# Altium schematic sheet YakupTrkn.SchDoc
size A4
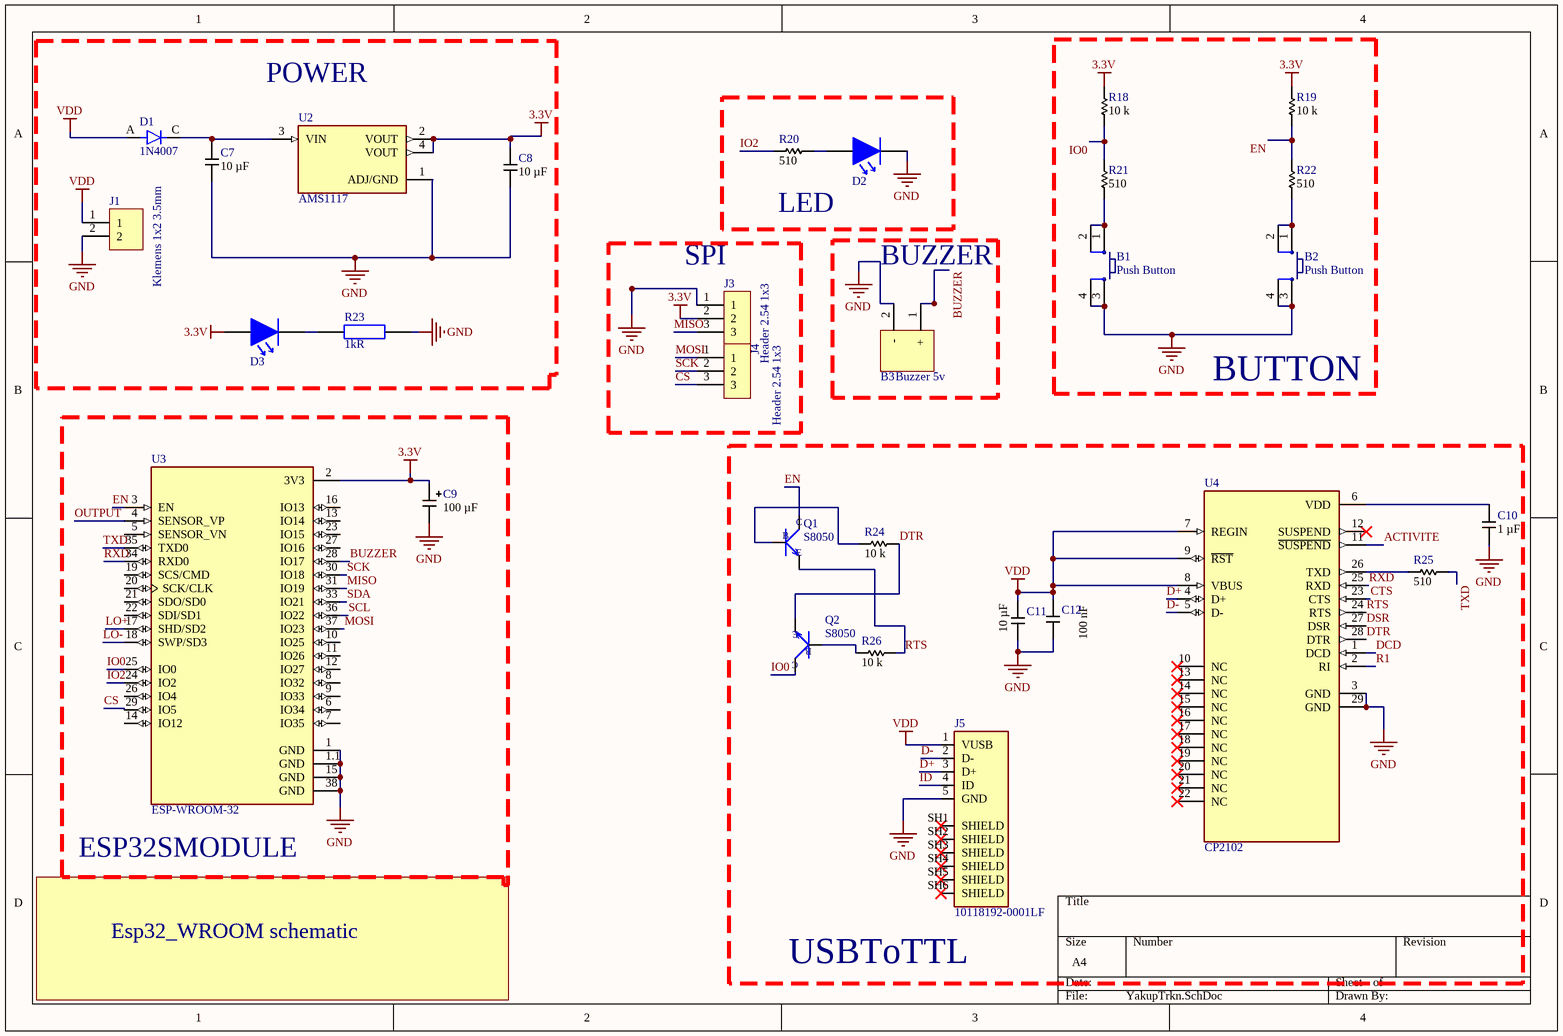
[diagram p0: YakupTrkn.SchDoc]

## Parts
B1  Push Button  [PUSB BUTTON-SMD]
B2  Push Button  [PUSB BUTTON-SMD]
B3  Buzzer 5v  [Buzzer 5v]
C7  Capacitance: 10 µF  [SAMSUNG_CAP_0805_140]  (hidden comment: CL21B106KPQNNNE)
C8  Capacitance: 10 µF  [SAMSUNG_CAP_0805_140]  (hidden comment: CL21B106KPQNNNE)
C9  Capacitance: 100 µF  [KEMET_CAP_TAN-B]  (hidden comment: T491B107K006AT)
C10  Capacitance: 1 µF  [SAMSUNG_CAP_0805_135]  (hidden comment: CL21B105KBFNNNE)
C11  Capacitance: 10 µF  [SAMSUNG_CAP_0805_140]  (hidden comment: CL21B106KPQNNNE)
C12  Capacitance: 100 nF  [SAMSUNG_CAP_0805_075]  (hidden comment: CL21B222KBANNNC)
D1  1N4007  [DIOAD1060W80L520D270]
D2  LTST-C171GKT  [LED_GREEN_0805]  (value not drawn)
D3  LH R974-LP-1  [LED_RED_0805]  (value not drawn)
J1  Klemens 1x2 3.5mm  [Klemens 1x2 - 3.5mm]
J3  Header 2.54 1x3  [Header 2.54 1x3]
J4  Header 2.54 1x3  [Header 2.54 1x3]
J5  10118192-0001LF  [AMPHENOL_10118192-0001LF]
Q1  S8050  [SOT-23]
Q2  S8050  [SOT-23]
R18  Resistance: 10 k  [ROYALOHM_RES_0805]  (hidden comment: 0805S8J0103T5E)
R19  Resistance: 10 k  [ROYALOHM_RES_0805]  (hidden comment: 0805S8J0103T5E)
R20  Resistance: 510  [ROYALOHM_RES_1206]  (hidden comment: 1206S4F5100T5E)
R21  Resistance: 510  [ROYALOHM_RES_1206]  (hidden comment: 1206S4F5100T5E)
R22  Resistance: 510  [ROYALOHM_RES_1206]  (hidden comment: 1206S4F5100T5E)
R23  Resistance: 1kR  [RES_0603]  (hidden comment: RC0603FR-0710KL)
R24  Resistance: 10 k  [ROYALOHM_RES_0805]  (hidden comment: 0805S8J0103T5E)
R25  Resistance: 510  [ROYALOHM_RES_1206]  (hidden comment: 1206S4F5100T5E)
R26  Resistance: 10 k  [ROYALOHM_RES_0805]  (hidden comment: 0805S8J0103T5E)
U2  AMS1117  [SOT229P700X180-4N]
U3  ESP-WROOM-32  [MODULE_ESP-WROOM-32]
U4  CP2102  [QFN50P500X500X100-29N]

## Nets
3.3V: C8.2 C9.1 D3.2 J3.2 R18.2 R19.2 U2.2(VOUT) U2.4(VOUT) U3.2(3V3)
GND: B1.3 B1.4 B2.3 B2.4 B3.2(-) C7.1 C8.1 C9.2 C10.2 C11.2 C12.1 D2.1 J1.2 J3.1 J5.5(GND) R23.1 U2.1(ADJ/GND) U3.1(GND) U3.1.1(GND) U3.15(GND) U3.38(GND) U4.3(GND) U4.29(GND)
VDD: C11.1 C12.2 D1.A J1.1 J5.1(VUSB) U4.7(REGIN) U4.8(VBUS) U4.9(~{RST})
ACTIVITE: U4.11(~{SUSPEND})
BUZZER: B3.1(+) U3.28(IO17)
CS: J4.3 U3.29(IO5)
CTS: U4.23(CTS)
D+: J5.3(D+) U4.4(D+)
D-: J5.2(D-) U4.5(D-)
DCD: U4.1(DCD)
DSR: U4.27(DSR)
DTR: Q2.2(E) R24.1 U4.28(DTR)
EN: Q1.3(C) R19.1 R22.1 U3.3(EN)
ID: J5.4(ID)
IO0: Q2.3(C) R18.1 R21.1 U3.25(IO0)
IO2: R20.1 U3.24(IO2)
LO+: U3.17(SHD/SD2)
LO-: U3.18(SWP/SD3)
MISO: J3.3 U3.31(IO19)
MOSI: J4.1 U3.37(IO23)
OUTPUT: U3.4(SENSOR_VP)
R1: U4.2(RI)
RTS: Q1.2(E) R26.2 U4.24(RTS)
RXD: U3.34(RXD0) U4.25(RXD)
SCK: J4.2 U3.30(IO18)
SCL: U3.36(IO22)
SDA: U3.33(IO21)
TXD: R25.2 U3.35(TXD0)
NetB1_1: B1.1 B1.2 R21.2
NetB2_1: B2.1 B2.2 R22.2
NetC7_2: C7.2 D1.C U2.3(VIN)
NetC10_1: C10.1 U4.6(VDD)
NetD2_2: D2.2 R20.2
NetD3_1: D3.1 R23.2
NetQ1_1: Q1.1(B) R24.2
NetQ2_1: Q2.1(B) R26.1
NetR25_1: R25.1 U4.26(TXD)

Not connected (* = marked no-connect by the designer): J5 SH1(SHIELD)* SH2(SHIELD)* SH3(SHIELD)* SH4(SHIELD)* SH5(SHIELD)* SH6(SHIELD)*; U3 5(SENSOR_VN) 6(IO34) 7(IO35) 8(IO32) 9(IO33) 10(IO25) 11(IO26) 12(IO27) 13(IO14) 14(IO12) 16(IO13) 19(SCS/CMD) 20(SCK/CLK) 21(SDO/SD0) 22(SDI/SD1) 23(IO15) 26(IO4) 27(IO16); U4 10(NC)* 12(SUSPEND)* 13(NC)* 14(NC)* 15(NC)* 16(NC)* 17(NC)* 18(NC)* 19(NC)* 20(NC)* 21(NC)* 22(NC)*

## Notes on the sheet
- (near U2) POWER
- LED
- (near J3) SPI
- BUZZER
- BUTTON
- (near U3) ESP32SMODULE
- Esp32_WROOM schematic
- (near J5) USBToTTL

## Library data of the parts
B1 B2 = Push Button: Smd Push Button; Satın Alma Linki: https://urun.n11.com/diger/mini-pushbutton-switch-smd-P227461537?gclid=Cj0KCQjwkoDmBRCcARIsAG3xzl8Y_-jeD7HocNM6lvuZ_rVp83568XPGtNzlPwXWLph8oCRqo0yh87UaApZYEALw_wcB&gclsrc=aw.ds
C7 C8 C11 = CL21B106KPQNNNE: CAP CER 10UF 10V X7R 0805; Supplier 1: Digi-Key; Supplier 2: Farnell; Supplier 3: Mouser; Supplier Part Number 1: 1276-1764-6-ND; Supplier Part Number 2: 3013487; Supplier Part Number 3: 187-CL21B106KPQNNNE
C9 = T491B107K006AT: CAP TANT 100UF 10% 6.3V 1411; Supplier 1: Digi-Key; Supplier 2: Farnell; Supplier 3: Mouser; Supplier Part Number 1: 399-8301-1-ND; Supplier Part Number 2: 1457438; Supplier Part Number 3: 80-T491B107K006
C10 = CL21B105KBFNNNE: CAP CER 1UF 50V X7R 0805; Supplier 1: Digi-Key; Supplier 2: Farnell; Supplier 3: Mouser; Supplier Part Number 1: 1276-1029-1-ND; Supplier Part Number 2: 3013482; Supplier Part Number 3: 187-CL21B105KBFNNNE
C12 = CL21B222KBANNNC: CAP CER 100NnF 50V X7R 0805; Supplier 1: Digi-Key; Supplier 2: Farnell; Supplier 3: Mouser; Supplier Part Number 1: 1276-1171-1-ND; Supplier Part Number 2: 3013488; Supplier Part Number 3: 187-CL21B222KBANNNC
D1 = 1N4007: Diode Switching 1KV 1A 2-Pin DO-41; MF: {'manufacturer': u'ON Semiconductor'}; MP: 1N4007; Availability: Unavailable; Value: *; Package: None; Price: None
D2 = LED GREEN 0805: Green 0805 130 º Min 5 mcd Typical 12 mcd Water Clear Lens SMT LED; Manufacturer: Vishay Lite-On; Designed by: BERK; Lens Color: Colorless; Viewing Angle: 130°; Lens Style: Diffused,Colorless,Rectangular,Clear; Luminous Intensity: 12mcd; Forward Current: 30mA; Forward Voltage: 2.1V; Power Rating: 100mW; Dominant Wavelength: 569nm; Test Current: 10mA; Number of Elements: 1; Wavelength: 585nm; Reverse Voltage: 5V; Supplier 1: Digi-Key; Manufacturer Part Number: LTST-C171GKT; RoHS: Yes; Category: LEDs; Stock 1: 159023; Pricing 1: 1=0,26000, 10=0,14100, 100=0,06560, 500=0,06060, 1000=0,04747 (USD); Mount: Surface Mount; Case/Package: 0805; Number of Pins: 2; Color: Green; Case Code (Metric): 2012; Case Code (Imperial): 0805; Min Operating Temperature: -55°C; Max Operating Temperature: 85°C; Package Quantity: 1; Packaging: Tape and Reel; Illumination Color: Green; Lens Transparency: Clear; Power Dissipation: 100mW; Number of LEDs: 1; Series: CHIPLED 0805; Length: 2mm; Width: 1.25mm; Height: 0.8mm; Depth: 1.25mm; Radiation Hardening: No; Lead Free: Lead Free; RoHS Compliant: Yes; ComponentLink1URL: https://datasheet.ciiva.com/2110/ltst-c171gkt-2110000.pdf?src-supplier=Digi-Key; ComponentLink1Description: https://datasheet.ciiva.com/2110/ltst-c171gkt-2110000.pdf?src-supplier=Digi-Key; ComponentLink2URL: https://datasheet.ciiva.com/11773/0900766b80dc0296-11773991.pdf?src-supplier=RSComponents; ComponentLink2Description: https://datasheet.ciiva.com/11773/0900766b80dc0296-11773991.pdf?src-supplier=RSComponents; ComponentLink3URL: https://datasheet.ciiva.com/12400/lite-on-ltst-c171gkt-190133-12400647.pdf?src-supplier=Mouser; ComponentLink3Description: https://datasheet.ciiva.com/12400/lite-on-ltst-c171gkt-190133-12400647.pdf?src-supplier=Mouser; ComponentLink4URL: https://datasheet.ciiva.com/2110/ltst-c171gkt-2110001.pdf?src-supplier=Digi-Key; ComponentLink4Description: https://datasheet.ciiva.com/2110/ltst-c171gkt-2110001.pdf?src-supplier=Digi-Key; ComponentLink5URL: https://datasheet.ciiva.com/2110/ltst-c171gkt-2110002.pdf?src-supplier=Digi-Key; ComponentLink5Description: https://datasheet.ciiva.com/2110/ltst-c171gkt-2110002.pdf?src-supplier=Digi-Key; ComponentLink6URL: https://datasheet.ciiva.com/16396/ltst-c171gkt-16396549.pdf?src-supplier=Future+Electronics; ComponentLink6Description: https://datasheet.ciiva.com/16396/ltst-c171gkt-16396549.pdf?src-supplier=Future+Electronics; Supplier Part Number 1: 160-1423-1-ND
D3 = LED RED 0805: LED Uni-Color Hyper Red 660nm 2-Pin Chip 0805(2012Metric) T/R; Manufacturer: Osram Opto; Lens Color: White; Forward Voltage: 1.8V; Lens Style: Diffused,Flat,Colorless; Luminous Intensity: 71mcd; Viewing Angle: 160°; Forward Current: 30mA; Dominant Wavelength: 645nm; Number of Elements: 1; Test Current: 20mA; Reverse Voltage: 5V; Lens Transparency: Diffused; Luminous Flux: 0.17lm; Lens Size: 1.25mm; Designed by: BERK; Supplier 1: Digi-Key; Manufacturer Part Number: LH R974-LP-1; RoHS: Yes; Category: LEDs; Stock 1: 35632; Pricing 1: 1=0,26000, 10=0,13900, 100=0,06480, 500=0,05978, 1000=0,04683, 2000=0,04584 (USD); Mount: Surface Mount; Case/Package: 0805; Number of Pins: 2; Color: Red; Case Code (Imperial): 0805; Case Code (Metric): 2012; Min Operating Temperature: -30°C; Max Operating Temperature: 85°C; Packaging: Tape and Reel; Illumination Color: Red; Package Quantity: 1; Series: CHipLED; Length: 2.1mm; Width: 1.25mm; Depth: 1.35mm; Radiation Hardening: No; RoHS Compliant: Yes; ComponentLink1URL: http://www.jameco.com/Jameco/Products/ProdDS/2085634.pdf?src-supplier=Jameco; ComponentLink1Description: http://www.jameco.com/Jameco/Products/ProdDS/2085634.pdf?src-supplier=Jameco; ComponentLink2URL: http://components.arrow.com/part/dataview/0323_01825492?src-supplier=Arrow+Europe; ComponentLink2Description: http://components.arrow.com/part/dataview/0323_01825492?src-supplier=Arrow+Europe; ComponentLink3URL: https://dammedia.osram.info/media/resource/hires/osram-dam-2493888/LH%20R974.pdf?src-supplier=Digi-Key; ComponentLink3Description: https://dammedia.osram.info/media/resource/hires/osram-dam-2493888/LH%20R974.pdf?src-supplier=Digi-Key; ComponentLink4URL: http://www.mouser.com/ds/2/311/LH%20R974%20-%20CHIPLED%200805-318659.pdf?src-supplier=Mouser; ComponentLink4Description: http://www.mouser.com/ds/2/311/LH%20R974%20-%20CHIPLED%200805-318659.pdf?src-supplier=Mouser; ComponentLink5URL: https://www.verical.com/server-webapp/html/getDatasheet?partID=258950&src-supplier=Verical; ComponentLink5Description: https://www.verical.com/server-webapp/html/getDatasheet?partID=258950&src-supplier=Verical; ComponentLink6URL: http://components.arrow.com/part/dataview/41971690S1077610N9133?src-supplier=Arrow+Electronics; ComponentLink6Description: http://components.arrow.com/part/dataview/41971690S1077610N9133?src-supplier=Arrow+Electronics; ComponentLink7URL: http://components.arrow.com/part/dataview/41971690S6190115N2128?src-supplier=Arrow+Electronics; ComponentLink7Description: http://components.arrow.com/part/dataview/41971690S6190115N2128?src-supplier=Arrow+Electronics; Supplier Part Number 1: 475-1415-1-ND
J5 = 10118192-0001LF: Single Port 5 Contact Horizontal Right Angle Shielded Micro B USB 2.0 Connector; MF: {'manufacturer': u'FCI'}; Package: None; Availability: Unavailable; Value: *; MP: 10118192-0001LF; Price: None
Q1 Q2 = SMD-TRANSISTORS-NPN-25V-500MW(SOT-23): 305010017; MF: {'manufacturer': u'UMW'}; MP: S8050; Availability: Unavailable; Package: None; Value: *; Price: None
R18 R19 R24 R26 = 0805S8J0103T5E: RES SMD 10K OHM 5% 1/8W 0805
R20-R22 R25 = 1206S4F5100T5E: RES SMD 510 OHM 1% 1/4W 1206
R23 = RES 1K OHM 0603: RES 1K %1 OHM 0603 SMD; Manufacturer: Yageo; Manufacturer Part Number: RC0603JR-071KL; Designed by: BERK; Tolerance: 5%; Temperature Coefficient: 100ppm/°C; Voltage Rating (DC): 50V; Power Rating: 100mW; Body Length: 1.6mm; Supplier 1: Digi-Key; RoHS: Yes; Category: Chip SMD Resistors; Stock 1: 5112056; Pricing 1: 1=0,10000, 10=0,01900, 100=0,00770, 1000=0,00344, 2500=0,00298 (USD); Case/Package: 0603; Number of Pins: 2; Contact Plating: Tin,Matte; Case Code (Imperial): 0603; Case Code (Metric): 1608; Size Code: 0603; Min Operating Temperature: -55°C; Max Operating Temperature: 155°C; Resistor Type: Thick Film; Packaging: Tape and Reel; Package Quantity: 5000; Voltage Rating: 50V; Termination: SMD/SMT; Series: RC; Resistance Tolerance: 5%; Construction: Rectangular; Length: 1.6mm; Width: 0.8mm; Height: 0.45mm; Depth: 0.8mm; Radiation Hardening: No; REACH SVHC: Unknown; Lead Free: Lead Free; Military Standard: Not; RoHS Compliant: Yes; ComponentLink1URL: https://datasheet.ciiva.com/8883/pyu-rc0603-51-rohs-l-4-8883051.pdf?src-supplier=Avnet; ComponentLink1Description: https://datasheet.ciiva.com/8883/pyu-rc0603-51-rohs-l-4-8883051.pdf?src-supplier=Avnet; ComponentLink2URL: https://datasheet.ciiva.com/7746/443971-7746461.pdf?src-supplier=Element14; ComponentLink2Description: https://datasheet.ciiva.com/7746/443971-7746461.pdf?src-supplier=Element14; ComponentLink3URL: https://datasheet.ciiva.com/22747/443971-22747533.pdf?src-supplier=Element14; ComponentLink3Description: https://datasheet.ciiva.com/22747/443971-22747533.pdf?src-supplier=Element14; ComponentLink4URL: https://datasheet.ciiva.com/7746/443971-7746462.pdf?src-supplier=Element14; ComponentLink4Description: https://datasheet.ciiva.com/7746/443971-7746462.pdf?src-supplier=Element14; Supplier Part Number 1: 311-1.0KGRCT-ND
U2 = AMS1117: Sot223/Pkg 1-Amp 5-Volt Low Drop Out Voltage Regulatator; MF: {'manufacturer': u'Advanced Monolithic Systems'}; Package: None; Price: None; Availability: Unavailable; MP: AMS1117; Value: *
U3 = ESP-WROOM-32: Module: combo; GPIO, I2C x2, I2S x2, SDIO, SPI x3, UART x3; 19.5dBm; MF: {'manufacturer': u'Olimex LTD'}; Availability: Unavailable; Price: None; MP: ESP-WROOM-32; Package: None; Value: *
U4 = CP2102: USB to UART Bridge; MF: {'manufacturer': u'Silicon Labs'}; Availability: Unavailable; Value: *; Package: None; Price: None; MP: CP2102